# Altium schematic sheet AdapterBoard.SchDoc
size C
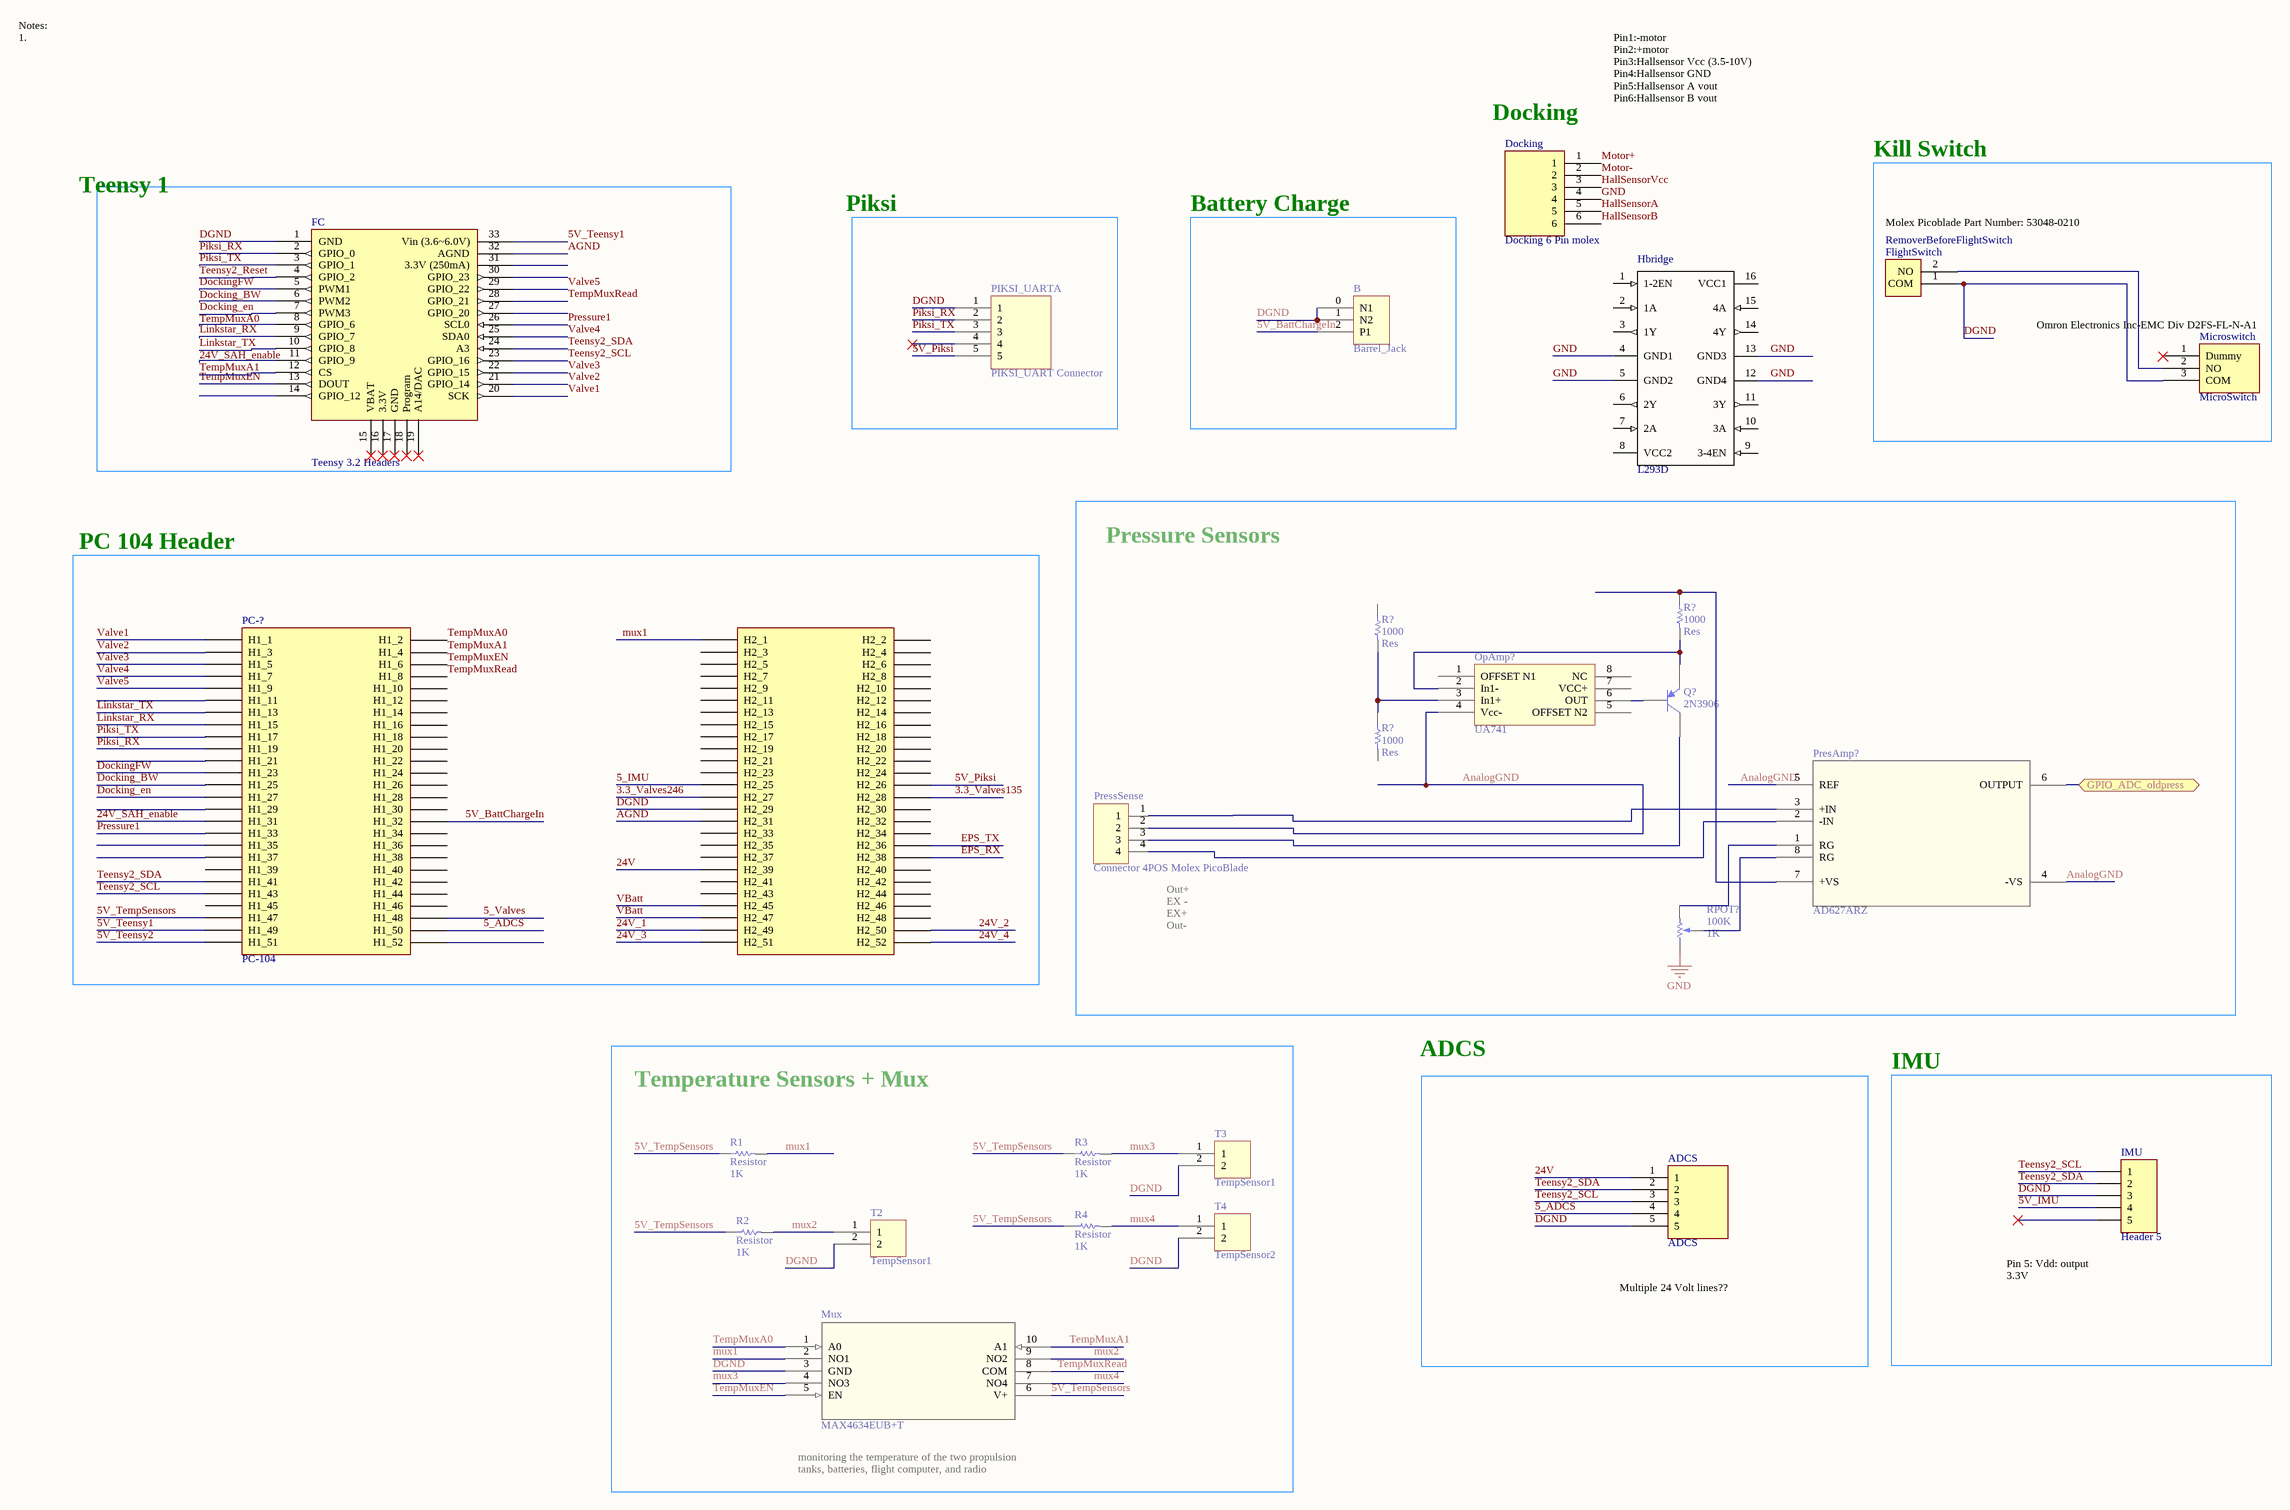
[diagram p0: AdapterBoard.SchDoc]

## Parts
(Parts that share a designator on the sheet are numbered #1, #2 ... from top to bottom, then left to right.)
ADCS  ADCS  [Molex Picoblade 5 Pin]
B  Barrel_Jack  [Barrel_Jack]
Docking  Docking 6 Pin molex  [Pressure Connector]
FC  Teensy 3.2 Headers  [Teensy 3.2 SMD Headers]
FlightSwitch  RemoverBeforeFlightSwitch  [RemoverBeforeFlight Switch]
Hbridge  L293D  [DIL16]
IMU  Header 5  [HDR1X5]
Microswitch  MicroSwitch  [MicroSwitch_3pin]
Mux  MAX4634EUB+T  [21-0061L]
OpAmp?  UA741  [UA741]
PC-?  PC-104  [PC-104FOOTPRINT]
PIKSI_UARTA  PIKSI_UART Connector  [Molex Picoblade 5 Pin]
PresAmp?  AD627ARZ  [R_8]
PressSense  Connector 4POS Molex PicoBlade  [532610471]
Q?  2N3906  [TO-92A]
R1  Resistor  value 1K  [AXIAL-0.3]
R2  Resistor  value 1K  [AXIAL-0.3]
R3  Resistor  value 1K  [AXIAL-0.3]
R4  Resistor  value 1K  [AXIAL-0.3]
R?#1  1000  value Res  [AXIAL-0.3]
R?#2  1000  value Res  [AXIAL-0.3]
R?#3  1000  value Res  [AXIAL-0.3]
RPOT?  100K  value 1K  [VR5]
T2  TempSensor1  [RemoverBeforeFlight Switch]
T3  TempSensor1  [RemoverBeforeFlight Switch]
T4  TempSensor2  [RemoverBeforeFlight Switch]

## Blocks framed on the sheet
Kill Switch: FlightSwitch Microswitch
Battery Charge: B
Pressure Sensors: OpAmp? PresAmp? PressSense Q? R?#1-R?#3 RPOT?
PC 104 Header: PC-?
Temperature Sensors + Mux: Mux R1-R4 T2-T4
ADCS: ADCS
IMU: IMU

## Ports
GPIO_ADC_oldpress (bidir)

## Nets
GND: Docking.4 Hbridge.4(GND1) Hbridge.5(GND2) Hbridge.12(GND4) Hbridge.13(GND3) RPOT?.1(TOP)
3.3_Valves135: PC-?.H2_28
3.3_Valves246: PC-?.H2_27
5_ADCS: ADCS.4 PC-?.H1_50
5_IMU: PC-?.H2_25
5_Valves: PC-?.H1_48
5V_BattChargeIn: B.2(P1) PC-?.H1_32
5V_IMU: IMU.4
5V_Piksi: PC-?.H2_26 PIKSI_UARTA.5
5V_Teensy1: FC.33(Vin_(3.6~6.0V)) PC-?.H1_49
5V_Teensy2: PC-?.H1_51
5V_TempSensors: Mux.6(V+) PC-?.H1_47 R1.1 R2.1 R3.1 R4.1
24V: ADCS.1 PC-?.H2_39
24V_1: PC-?.H2_49
24V_2: PC-?.H2_50
24V_3: PC-?.H2_51
24V_4: PC-?.H2_52
24V_SAH_enable: FC.11(GPIO_9) PC-?.H1_31
AGND: FC.32(AGND) PC-?.H2_31
AnalogGND: OpAmp?.4(Vcc-) PresAmp?.4(-VS) PresAmp?.5(REF) PressSense.2
DGND: ADCS.5 B.0(N1) B.1(N2) FC.1(GND) FlightSwitch.1(COM) IMU.3 Microswitch.3(COM) Mux.3(GND) PC-?.H2_29 PIKSI_UARTA.1 T2.2 T3.2 T4.2
Docking_BW: FC.6(PWM2) PC-?.H1_25
Docking_en: FC.7(PWM3) PC-?.H1_27
DockingFW: FC.5(PWM1) PC-?.H1_23
EPS_RX: PC-?.H2_38
EPS_TX: PC-?.H2_36
GPIO_ADC_oldpress: PresAmp?.6(OUTPUT) ; port GPIO_ADC_oldpress
HallSensorA: Docking.5
HallSensorB: Docking.6
HallSensorVcc: Docking.3
Linkstar_RX: FC.9(GPIO_7) PC-?.H1_15
Linkstar_TX: FC.10(GPIO_8) PC-?.H1_13
Motor+: Docking.1
Motor-: Docking.2
mux1: Mux.2(NO1) PC-?.H2_1 R1.2
mux2: Mux.9(NO2) R2.2 T2.1
mux3: Mux.4(NO3) R3.2 T3.1
mux4: Mux.7(NO4) R4.2 T4.1
Piksi_RX: FC.2(GPIO_0) PC-?.H1_19 PIKSI_UARTA.2
Piksi_TX: FC.3(GPIO_1) PC-?.H1_17 PIKSI_UARTA.3
Pressure1: FC.26(SCL0) PC-?.H1_33
Teensy2_Reset: FC.4(GPIO_2)
Teensy2_SCL: ADCS.3 FC.23(GPIO_16) IMU.1 PC-?.H1_43
Teensy2_SDA: ADCS.2 FC.24(A3) IMU.2 PC-?.H1_41
TempMuxA0: FC.8(GPIO_6) Mux.1(A0) PC-?.H1_2
TempMuxA1: FC.12(CS) Mux.10(A1) PC-?.H1_4
TempMuxEN: FC.13(DOUT) Mux.5(EN) PC-?.H1_6
TempMuxRead: FC.28(GPIO_21) Mux.8(COM) PC-?.H1_8
Valve1: FC.20(SCK) PC-?.H1_1
Valve2: FC.21(GPIO_14) PC-?.H1_3
Valve3: FC.22(GPIO_15) PC-?.H1_5
Valve4: FC.25(SDA0) PC-?.H1_7
Valve5: FC.29(GPIO_22) PC-?.H1_9
VBatt: PC-?.H2_45 PC-?.H2_47
NetFlightSwitch_2: FlightSwitch.2(NO) Microswitch.2(NO)
NetOpAmp?_2: OpAmp?.2(In1-) Q?.1(E) R?#1.2
NetOpAmp?_3: OpAmp?.3(In1+) R?#2.2 R?#3.1
NetOpAmp?_6: OpAmp?.6(OUT) Q?.2(B)
NetPresAmp?_1: PresAmp?.1(RG) RPOT?.2(BOT)
NetPresAmp?_2: PresAmp?.2(-IN) PressSense.4
NetPresAmp?_3: PresAmp?.3(+IN) PressSense.1
NetPresAmp?_7: PresAmp?.7(+VS) R?#1.1
NetPresAmp?_8: PresAmp?.8(RG) RPOT?.3(TAP)
NetPressSense_3: PressSense.3 Q?.3(C)

Not connected (* = marked no-connect by the designer): FC 14(GPIO_12) 15(VBAT)* 16(3.3V)* 17(GND)* 18(Program)* 19(A14/DAC)* 27(GPIO_20) 30(GPIO_23) 31(3.3V_(250mA)); Hbridge 1(1-2EN) 2(1A) 3(1Y) 6(2Y) 7(2A) 8(VCC2) 9(3-4EN) 10(3A) 11(3Y) 14(4Y) 15(4A) 16(VCC1); IMU 5*; Microswitch 1(Dummy)*; OpAmp? 1(OFFSET_N1) 5(OFFSET_N2) 7(VCC+) 8(NC); PC-? H1_10 H1_11 H1_12 H1_14 H1_16 H1_18 H1_20 H1_21 H1_22 H1_24 H1_26 H1_28 H1_29 H1_30 H1_34 H1_35 H1_36 H1_37 H1_38 H1_39 H1_40 H1_42 H1_44 H1_45 H1_46 H1_52 H2_2 H2_3 H2_4 H2_5 H2_6 H2_7 H2_8 H2_9 H2_10 H2_11 H2_12 H2_13 H2_14 H2_15 H2_16 H2_17 H2_18 H2_19 H2_20 H2_21 H2_22 H2_23 H2_24 H2_30 H2_32 H2_33 H2_34 H2_35 H2_37 H2_40 H2_41 H2_42 H2_43 H2_44 H2_46 H2_48; PIKSI_UARTA 4*; R?#2 1; R?#3 2

## Notes on the sheet
- Notes:
  1.
- (near Docking) Docking
- Pin1:-motor
  Pin2:+motor
  Pin3:Hallsensor Vcc (3.5-10V)
  Pin4:Hallsensor GND
  Pin5:Hallsensor A vout
  Pin6:Hallsensor B vout
- Teensy 1
- Piksi
- (near FlightSwitch) Molex Picoblade Part Number: 53048-0210
- (near Microswitch) Omron Electronics Inc-EMC Div D2FS-FL-N-A1
- (near PressSense) Out+
  EX -
  EX+
  Out-
- (near IMU) Pin 5: Vdd: output 3.3V
- Multiple 24 Volt lines??
- monitoring the temperature of the two propulsion tanks, batteries, flight computer, and radio

## Library data of the parts
ADCS PIKSI_UARTA = PIKSI_UART Connector: Molex Picoblade 53261-0571
Docking = PressureConnector: Molex 70553-0005
FlightSwitch T2-T4 = RemoverBeforeFlightSwitch: 53048-0210 Molex Picoblade
Hbridge = L293D: Driver; 36V; Power DIP; 600mA Low LevelO/P; 1.2A O/P High Level; 4 Drivers; 7V; MF: STMicroelectronics; Package: SOIC-20 STMicroelectronics; MP: L293D; Availability: Good; Price: 2.59 USD; Value: *
IMU = Header 5: Header, 5-Pin; LatestRevisionDate: 17-Jul-2002; LatestRevisionNote: Re-released for DXP Platform.; Publisher: Altium Limited
Microswitch = MicroSwitch: Omron Electronics Inc-EMC Div D2FS-FL-N-A1
Mux = MAX4634EUB+T: Imported; Vendor: Maxim Integrated Products; C: Copyright (C) 2015 Accelerated Designs. All rights reserved; Manufacturer_Part_Number: MAX4634EUB+T; Value: Value; Type: Type; RefDes: RefDes
PC-? = PC-104: ESQ-126-14-G-D (2 total needed)
PresAmp? = AD627ARZ: Imported; Manufacturer_Part_Number: AD627ARZ; Vendor: Vendor; RefDes: Refdes; Type: Type; Value: Value
PressSense = 532610471
Q? = 2N3906: PNP General Purpose Amplifier; Published: 8-Jun-2000; LatestRevisionDate: 15-Jan-2003; LatestRevisionNote: PCB Footprint 'BCY-W3/D4.7' replaced; DatasheetVersion: 1997; PackageVersion: Sep-1998; PackageReference: TO-92A; Publisher: Altium Limited; PackageDescription: TO, Flat Index; 3 In-Line, Axial Leads; Body Dia. 4.5mm; Leads 0.51 x 0.48 mm (max); ComponentLink1Description: Manufacturer Link; ComponentLink1URL: http://www.fairchildsemi.com/; ComponentLink2Description: Datasheet; ComponentLink2URL: http://www.fairchildsemi.com/ds/2N%2F2N3906.pdf
R1-R4 = Res1: Published: 8-Jun-2000; LatestRevisionDate: 17-Jul-2002; LatestRevisionNote: Re-released for DXP Platform.; PackageReference: AXIAL-0.3; Publisher: Altium Limited; PackageDescription: Axial Device, Thru-Hole; 2 Leads; 0.3 in Pin Spacing
R?#1-R?#3 = Res1: Resistor- 696-1552-ND; Published: 8-Jun-2000; LatestRevisionDate: 17-Jul-2002; LatestRevisionNote: Re-released for DXP Platform.; PackageReference: AXIAL-0.3; Publisher: Altium Limited; PackageDescription: Axial Device, Thru-Hole; 2 Leads; 0.3 in Pin Spacing
RPOT? = RPot: Potentiometer; Sim Note: Enter the Resistance value and the set point into parameter fields.; Set Position: 0.5; Published: 8-Jun-2000; LatestRevisionDate: 17-Jul-2002; LatestRevisionNote: Re-released for DXP Platform.; PackageReference: VR5; Publisher: Altium Limited; PackageDescription: Variable Resistor, Thru-Hole; 3 Leads